# Altium schematic sheet block_diagram.SchDoc
size A4
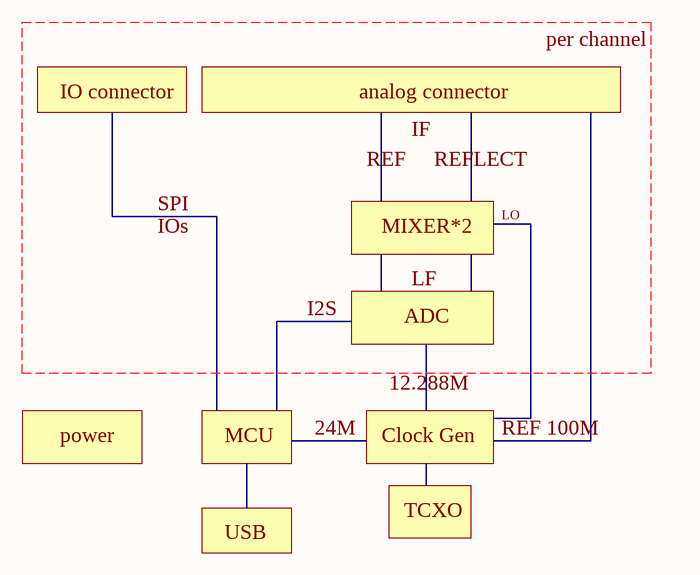
[diagram p0: block_diagram.SchDoc]

## Notes on the sheet
- per channel
- IO connector
- analog connector
- REF
- IF
- REFLECT
- SPI
- IOs
- MIXER*2
- I2S
- ADC
- LF
- 12.288M
- power
- MCU
- 24M
- Clock Gen
- REF 100M
- USB
- TCXO